# EAGLE design usb tester (EAGLE 6.5.0)
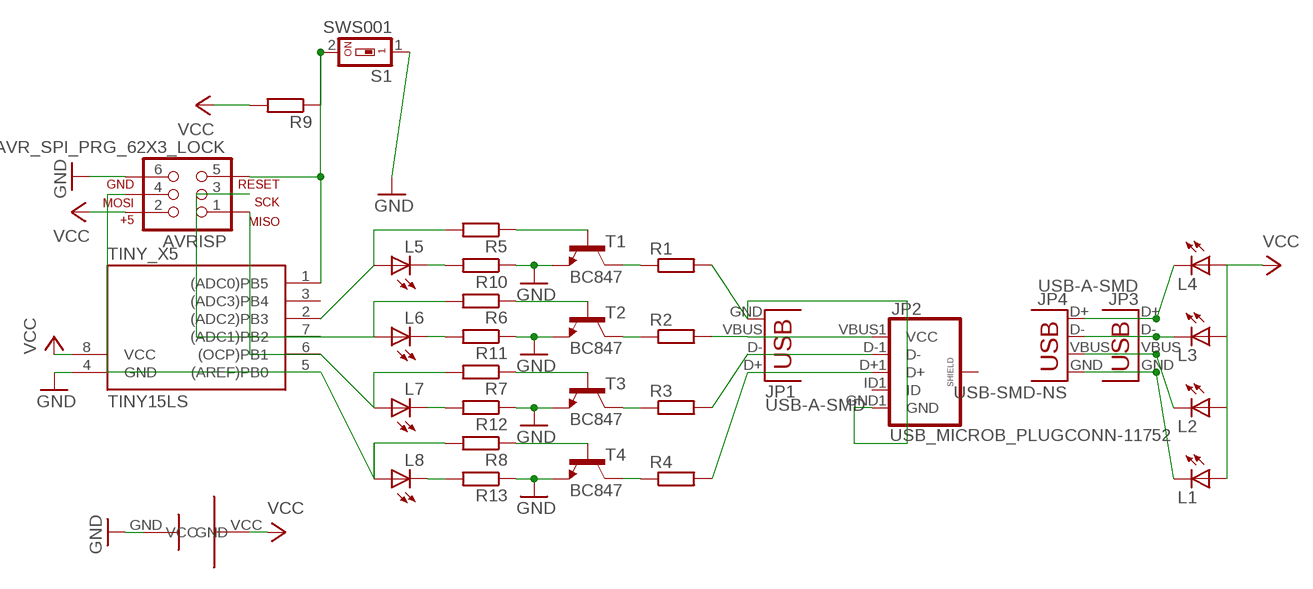
[diagram p0: schematic, sheet 1]

## Parts
AVRISP  AVR_SPI_PRG_62X3_LOCK  [2X3_LOCK]
JP1  USB-A-SMD  [USB-A-S-NOSILK-FEMALE]
JP2  USB_MICROB_PLUGCONN-11752  [USB-B-MICRO-SMD_V03]
JP3  USB-A-SMD  [USB-A-S-NOSILK-FEMALE]
JP4  USB-SMD-NS  [USB-MINIB-NOSTOP]
L1  LEDSMT1206  [1206]
L2  LEDSMT1206  [1206]
L3  LEDSMT1206  [1206]
L4  LEDSMT1206  [1206]
L5  LEDSMT1206  [1206]
L6  LEDSMT1206  [1206]
L7  LEDSMT1206  [1206]
L8  LEDSMT1206  [1206]
R1  R-EU_R1206  [R1206]
R2  R-EU_R1206  [R1206]
R3  R-EU_R1206  [R1206]
R4  R-EU_R1206  [R1206]
R5  R-EU_R1206  [R1206]
R6  R-EU_R1206  [R1206]
R7  R-EU_R1206  [R1206]
R8  R-EU_R1206  [R1206]
R9  R-EU_R1206  [R1206]
R10  R-EU_R1206  [R1206]
R11  R-EU_R1206  [R1206]
R12  R-EU_R1206  [R1206]
R13  R-EU_R1206  [R1206]
S1  SWS001  [SMS-001]
T1  BC847  [SOT23]
T2  BC847  [SOT23]
T3  BC847  [SOT23]
T4  BC847  [SOT23]
TINY_X5  TINY15LS  [SOIC8]
U$1  BATTERY  [BATTERY]

## Nets
GND: AVRISP.6 R10.1 R11.1 R12.1 R13.1 S1.1 T1.2(E) T2.2(E) T3.2(E) T4.2(E) TINY_X5.4(GND) U$1.GND
N$1: R1.1 T1.3(C)
N$2: R2.1 T2.3(C)
N$3: R3.1 T3.3(C)
N$4: R4.1 T4.3(C)
N$5: R5.1 T1.1(B)
N$7: R7.1 T3.1(B)
N$8: AVRISP.1 L7.A R7.2 TINY_X5.6((OCP)PB1)
N$9: R8.1 T4.1(B)
N$10: JP1.GND JP2.GND1(GND) R1.2
N$11: JP1.VBUS JP2.VBUS1(VCC) R2.2
N$12: JP1.D- JP2.D-1(D-) R3.2
N$13: JP1.D+ JP2.D+1(D+) R4.2
N$14: AVRISP.4 L8.A R8.2 TINY_X5.5((AREF)PB0)
N$16: L5.A R5.2 TINY_X5.2((ADC2)PB3)
N$19: JP3.GND JP4.GND L1.C
N$20: JP3.VBUS JP4.VBUS L2.C
N$21: JP3.D- JP4.D- L3.C
N$22: JP3.D+ JP4.D+ L4.C
N$25: L8.C R13.2
N$26: AVRISP.5 R9.1 S1.2 TINY_X5.1((ADC0)PB5)
N$27: AVRISP.3 L6.A R6.2 TINY_X5.7((ADC1)PB2)
N$30: L5.C R10.2
N$31: L6.C R11.2
N$32: L7.C R12.2
N$33: R6.1 T2.1(B)
VCC: AVRISP.2 L1.A L2.A L3.A L4.A R9.2 TINY_X5.8(VCC) U$1.VCC
Unconnected: JP2.ID1(ID) JP2.SHIELD1(SHIELD) JP2.SHIELD2(SHIELD) JP2.SHIELD3(SHIELD) TINY_X5.3((ADC3)PB4)

## Library data of the parts
AVRISP = SparkFun-Connectors:AVR_SPI_PRG_6: AVR ISP 6 Pin This is the reduced ISP connector for AVR programming. Common on Arduino. This footprint will take up less PCB space and can be used with a 10-pin to 6-pin adapter such as SKU: BOB-08508 **Special note about "TEST_POINT" package. The stop mask is on the top side, so if you want your programming test points to be on the bottom of your board, make sure to place this package on the bottom side of the board. This also ensure that the orientation to program from the bottom side will be correct.
JP1 JP3 = SparkFun-Connectors:USB: USB Connectors USB-B-PTH is fully proven SKU : PRT-00139/CONN-08278 USB-miniB is fully proven SKU : PRT-00587 USB-A-PCB is untested. USB-A-H is throughly reviewed, but untested. Spark Fun Electronics SKU : PRT-00437 USB-B-SMT is throughly reviewed, but untested. Needs silkscreen touching up. USB-A-S has not been used/tested USB-MB-H has not been used/tested USB-MICROB has been used. CONN-09505; PROD_ID: CONN-09520
JP2 = SparkFun-Connectors:USB_MICROB_PLUG: USB Micro-B connectors Some male, some female. Watch your step!; PROD_ID: CONN-11752
JP4 = SparkFun-Connectors:USB: USB Connectors USB-B-PTH is fully proven SKU : PRT-00139/CONN-08278 USB-miniB is fully proven SKU : PRT-00587 USB-A-PCB is untested. USB-A-H is throughly reviewed, but untested. Spark Fun Electronics SKU : PRT-00437 USB-B-SMT is throughly reviewed, but untested. Needs silkscreen touching up. USB-A-S has not been used/tested USB-MB-H has not been used/tested USB-MICROB has been used. CONN-09505
L1-L8 = led:LED: LED OSRAM: - CHIPLED LG R971, LG N971, LY N971, LG Q971, LY Q971, LO R971, LY R971 LH N974, LH R974 LS Q976, LO Q976, LY Q976 LO Q996 - Hyper CHIPLED LW Q18S LB Q993, LB Q99A, LB R99A - SideLED LS A670, LO A670, LY A670, LG A670, LP A670 LB A673, LV A673, LT A673, LW A673 LH A674 LY A675 LS A676, LA A676, LO A676, LY A676, LW A676 LS A679, LY A679, LG A679 - Hyper Micro SIDELED® LS Y876, LA Y876, LO Y876, LY Y876 LT Y87S - SmartLED LW L88C, LW L88S LB L89C, LB L89S, LG L890 LS L89K, LO L89K, LY L89K LS L896, LA L896, LO L896, LY L896 - TOPLED LS T670, LO T670, LY T670, LG T670, LP T670 LSG T670, LSP T670, LSY T670, LOP T670, LYG T670 LG T671, LOG T671, LSG T671 LB T673, LV T673, LT T673, LW T673 LH T674 LS T676, LA T676, LO T676, LY T676, LB T676, LH T676, LSB T676, LW T676 LB T67C, LV T67C, LT T67C, LS T67K, LO T67K, LY T67K, LW E67C LS E67B, LA E67B, LO E67B, LY E67B, LB E67C, LV E67C, LT E67C LW T67C LS T679, LY T679, LG T679 LS T770, LO T770, LY T770, LG T770, LP T770 LB T773, LV T773, LT T773, LW T773 LH T774 LS E675, LA E675, LY E675, LS T675 LS T776, LA T776, LO T776, LY T776, LB T776 LHGB T686 LT T68C, LB T68C - Hyper Mini TOPLED® LB M676 - Mini TOPLED Santana® LG M470 LS M47K, LO M47K, LY M47K Source: http://www.osram.convergy.de LUXEON: - LUMILED® LXK2-PW12-R00, LXK2-PW12-S00, LXK2-PW14-U00, LXK2-PW14-V00 LXK2-PM12-R00, LXK2-PM12-S00, LXK2-PM14-U00 LXK2-PE12-Q00, LXK2-PE12-R00, LXK2-PE12-S00, LXK2-PE14-T00, LXK2-PE14-U00 LXK2-PB12-K00, LXK2-PB12-L00, LXK2-PB12-M00, LXK2-PB14-N00, LXK2-PB14-P00, LXK2-PB14-Q00 LXK2-PR12-L00, LXK2-PR12-M00, LXK2-PR14-Q00, LXK2-PR14-R00 LXK2-PD12-Q00, LXK2-PD12-R00, LXK2-PD12-S00 LXK2-PH12-R00, LXK2-PH12-S00 LXK2-PL12-P00, LXK2-PL12-Q00, LXK2-PL12-R00 Source: www.luxeon.com KINGBRIGHT: KA-3528ASYC Source: www.kingbright.com
R1-R13 = rcl:R-EU_: RESISTOR, European symbol
S1 = smd-special:SWS001: SMD Dip Switch 1 pol.
T1-T4 = transistor:BC847: NPN TRANSISTOR
TINY_X5 = atmel:TINY15L: MICROCONTROLLER 2.7 V 1 Kbytes FLASH 64 bytes EEPROM 4-channel 10 bit ADC; OC_FARNELL: unknown; OC_NEWARK: unknown
U$1 = USB_tester:BATTERY

## Board
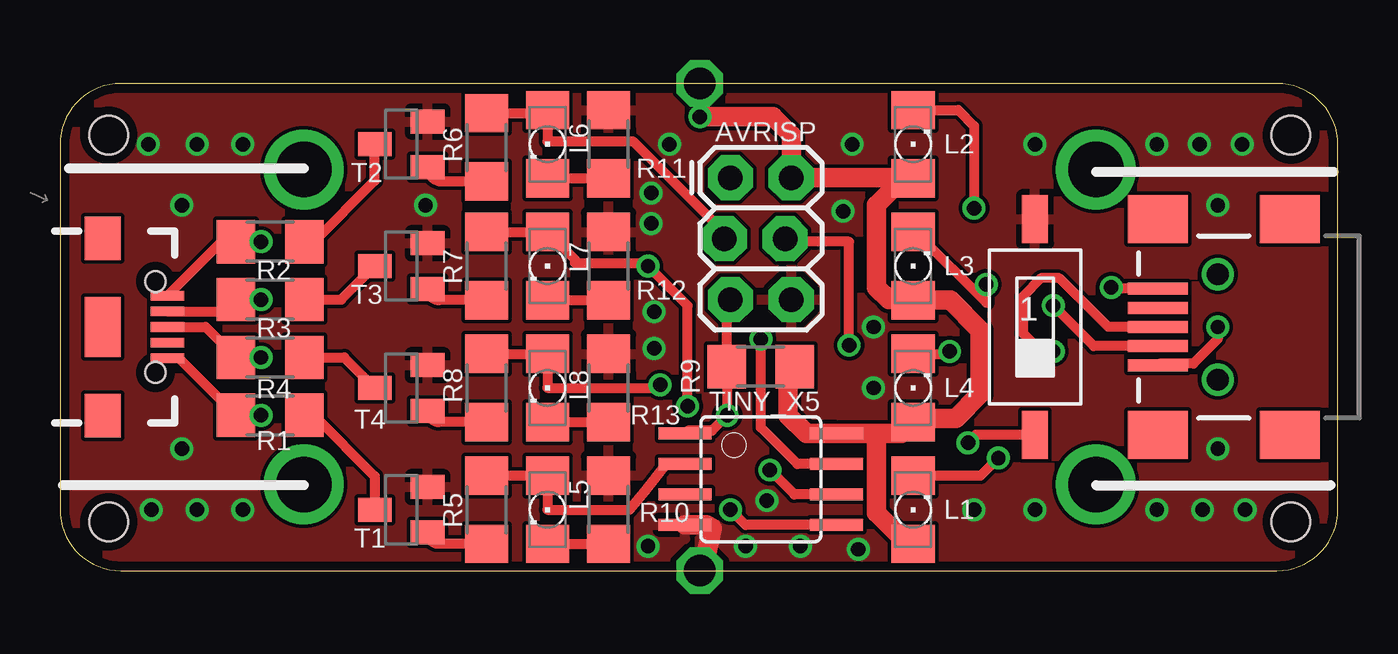
[diagram p1: board, top side]
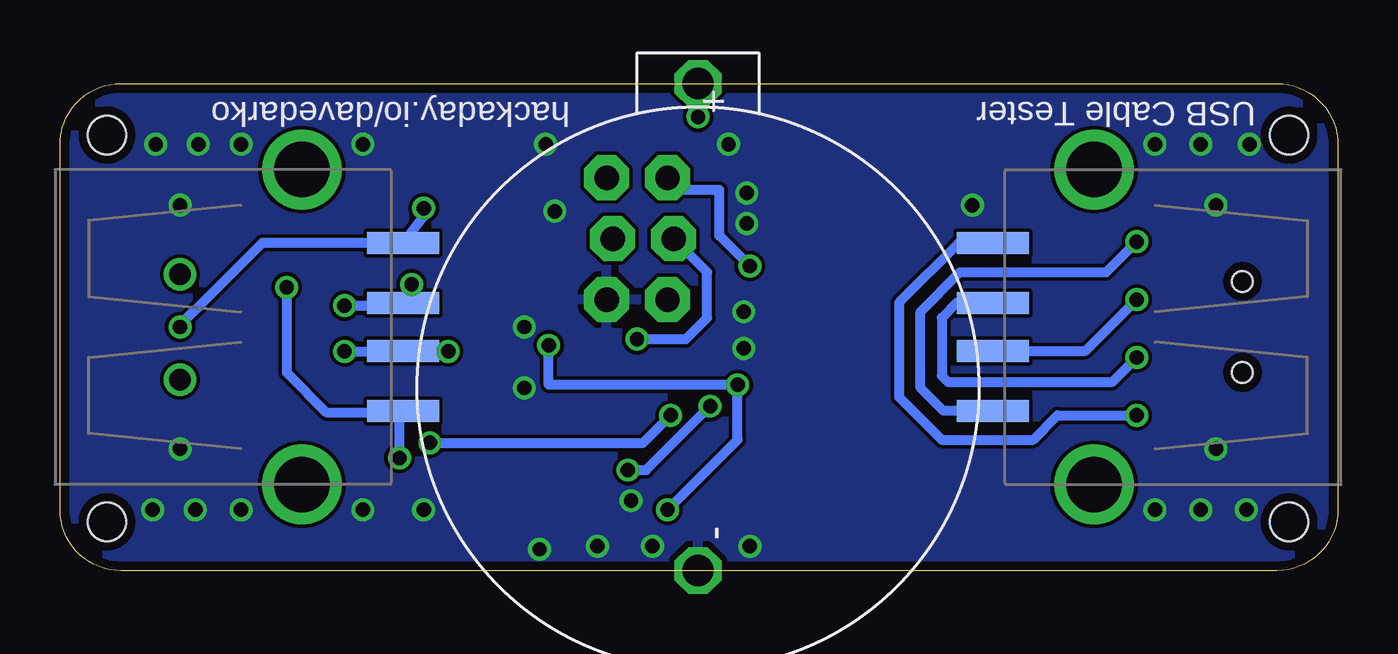
[diagram p2: board, bottom side, seen from below]

Size 53.26 x 20.31 mm. Coordinates in mm from the lower left corner, seen from the top.
Outline: 0,17.77 0,2.54 arc90 2.54,0 50.72,0 arc90 53.26,2.54 53.26,17.77 arc90 50.72,20.31 2.54,20.31 arc90 0,17.77
Copper layers (1*16): Top 0.0356mm / dielectric 1.5011mm / Bottom 0.0356mm
Design rules "LaenPCBOrder *": minimum track width 6mil, minimum drill 13mil, track to track 6mil, track to pad 6mil, pad to pad 6mil, via to via 6mil, smd to smd 6mil, copper to edge 15mil, drill to drill 6mil, minimum pad ring 7mil, minimum via ring 7mil, stop-mask expansion 3mil, vias tented up to drill 2000mil, thermal gap 10mil
Holes 1.6 mm at 51.31,2.03 51.31,18.16 2.03,18.16 2.03,2.03

### Footprints (pad centres in the part's own frame; a part is rotated, then mirrored left to right if it is on the bottom)
2X3_LOCK = drill 1.016 pad 1.88 octagon: 1 0,0; 2 0,2.54; 3 2.54,-0.254; 4 2.54,2.286; 5 5.08,0; 6 5.08,2.54
USB-A-S-NOSILK-FEMALE = smd 3 x 0.9: D+ 4.212,-1; D- 4.212,1; GND 4.212,-3.5; VBUS 4.212,3.5 | drill 2.311: S1 0,-6.566; S2 0,6.566
USB-B-MICRO-SMD_V03 = smd 1.4 x 0.4: D+1 2.7,0; D-1 2.7,0.65; GND1 2.7,-1.3; ID1 2.7,-0.65; VBUS1 2.7,1.3 | smd 1.5 x 1.8: SHIELD1 0,3.7; SHIELD2 0,-3.7 | smd 1.5 x 2.5: SHIELD3 0,0 | hole 0.85: 2.2,1.9; 2.2,-1.9
USB-MINIB-NOSTOP = smd 2.5 x 0.5: D+ 2.5,0; D- 2.5,0.8; GND 2.5,-1.6; ID 2.5,-0.8; VBUS 2.5,1.6 | smd 2.5 x 2: G1 -3,-4.5; G2 -3,4.5; G3 2.5,4.5; G4 2.5,-4.5 | drill 0.9 pad 0.8: H1 0,2.2 | drill 0.9 pad 0.787: H2 0,-2.2
1206 = smd 1.6 x 1.803: A -1.422,0; C 1.422,0
R1206 = smd 1.6 x 1.803: 1 -1.422,0; 2 1.422,0
SMS-001 = smd 1.092 x 2.007: 1 0,-4.496; 2 0,4.496
SOT23 = smd 1 x 1.4: 1 -0.95,-1.1; 2 0.95,-1.1; 3 0,1.1
SOIC8 = smd 0.5 x 2.2: 1 -1.905,-3.154; 2 -0.645,-3.154; 3 0.625,-3.154; 4 1.895,-3.154; 5 1.905,3.154; 6 0.635,3.154; 7 -0.635,3.154; 8 -1.905,3.154
BATTERY = drill 1.3 octagon: GND -10.16,0; VCC 10.16,0

### Placement (x,y rotation side)
AVRISP  27.94,16.38 270 top
JP1  10.16,10.16 180 bottom
JP2  1.78,10.16 0 top
JP3  43.18,10.16 0 bottom
JP4  48.26,10.16 180 top
L1  35.56,2.54 90 top
L2  35.56,17.78 90 top
L3  35.56,12.7 90 top
L4  35.56,7.62 90 top
L5  20.32,2.54 270 top
L6  20.32,17.78 270 top
L7  20.32,12.7 270 top
L8  20.32,7.62 270 top
R1  8.76,6.48 180 top
R2  8.76,13.72 180 top
R3  8.76,11.3 180 top
R4  8.76,8.89 180 top
R5  17.78,2.54 90 top
R6  17.78,17.65 90 top
R7  17.78,12.7 90 top
R8  17.78,7.62 90 top
R9  29.21,8.51 0 top
R10  22.86,2.54 270 top
R11  22.86,17.78 270 top
R12  22.86,12.7 270 top
R13  22.86,7.62 270 top
S1  40.64,10.16 180 top
T1  14.22,2.54 90 top
T2  14.22,17.78 90 top
T3  14.22,12.7 90 top
T4  14.22,7.62 90 top
TINY_X5  29.21,3.81 270 top
U$1  26.67,10.16 90 bottom

### Tracks (layer width: path | path; a pad name or v marks a point on that pad's centre or on a via)
GND  (via drill 0.6)
  Top 0.813: U$1.GND 26.8,0 27.18,1.78 26.95,1.91 TINY_X5.4
  other vias: 40.64,17.78 33.02,17.78 40.64,2.54 49.4,2.54 47.62,2.54 48.26,5.08 48.26,15.24 49.28,17.78 47.5,17.78 32.64,14.99 25.4,17.78 15.24,15.24 5.71,2.54 3.81,2.54 5.08,5.08 5.08,15.24 5.71,17.78 3.68,17.78 24.77,9.27 24.77,10.79 29.46,2.92 38.1,2.54 33.91,10.16 33.91,7.62 7.62,2.54 7.62,17.78 45.72,17.78 45.72,2.54 24.64,14.48 24.64,15.75 33.27,0.89 24.51,1.02 30.86,1.02 28.57,1.02
  pour Top: 0,20.32 53.34,20.32 53.34,0 0,0
  pour Bottom: 0,20.32 55.88,20.32 55.88,0 0,0
N$1
  Top 0.406: R1.1 10.58,6.48 13.12,3.94 T1.3
N$2
  Top 0.406: R2.1 10.58,13.72 13.12,16.26 T2.3
N$3
  Top 0.406: R3.1 11.73,11.3 T3.3
N$4
  Top 0.406: R4.1 11.85,8.89 T4.3
N$5
  Top 0.406: R5.1 15.8,1.12 arc-90 T1.1
N$7
  Top 0.406: R7.1 15.8,11.28 arc-90 T3.1
N$8  (via drill 0.6)
  Top 0.406: R7.2 L7.A 21.46,12.98 21.46,12.83 24.38,12.83 v24.51,12.7 26.16,11.05 v26.16,6.86 | TINY_X5.6 30.61,3.17 v29.59,4.19
  Bottom 0.406: v24.51,12.7 25.78,13.97 25.78,15.88 27.43,15.88 AVRISP.1 | v29.59,4.19 28.83,4.19 v26.16,6.86
N$9
  Top 0.406: R8.1 15.8,6.2 arc-90 T4.1
N$10  (via drill 0.6)
  Top 0.406: JP2.GND1 4.96,8.86 R1.2 v8.38,6.48
  Bottom 0.406: JP1.GND 15.8,13.66 18.29,11.18 18.29,7.24 16.51,5.46 12.7,5.46 11.68,6.48 v8.38,6.48
N$11  (via drill 0.6)
  Top 0.406: JP2.VBUS1 6.73,13.72 R2.2 v8.38,13.72
  Bottom 0.406: JP1.VBUS 16.44,6.66 17.4,7.62 17.4,10.79 15.75,12.45 9.65,12.45 v8.38,13.72
N$12  (via drill 0.6)
  Top 0.406: JP2.D-1 6.85,10.81 R3.2 v8.38,11.3
  Bottom 0.406: JP1.D- 10.53,9.16 v8.38,11.3
N$13  (via drill 0.6)
  Top 0.406: JP2.D+1 6.07,10.16 6.85,9.39 R4.2 v8.38,8.89
  Bottom 0.406: JP1.D+ 15.89,11.16 16.51,10.54 16.51,8.13 16.26,7.87 9.4,7.87 v8.38,8.89
N$14  (via drill 0.6)
  Top 0.406: R8.2 L8.A 20.32,7.62 24.89,7.62 v25.02,7.75 | v32.89,9.4 32.89,13.72 30.35,13.72 AVRISP.4 | TINY_X5.5 28.57,1.91 v27.94,2.54
  Bottom 0.406: v32.89,9.4 32.89,7.75 v25.02,7.75 25.02,5.46 v27.94,2.54
N$16
  Top 0.406: R5.2 L5.A 20.32,2.54 23.75,2.54 24.38,3.3 25.28,4.45 TINY_X5.2
N$19  (via drill 0.6)
  Top 0.406: JP4.GND 43.87,11.76 v43.81,11.81 | L1.C 38.38,3.96 v39.12,4.7
  Bottom 0.406: v43.81,11.81 43.81,8.26 42.16,6.6 39.28,6.6 JP3.GND 39.12,6.55 v39.12,4.7
N$20  (via drill 0.6)
  Top 0.406: v48.26,10.16 48.26,9.65 47.24,8.64 45.84,8.64 JP4.VBUS | L2.C 37.44,19.2 38.1,18.54 v38.1,15.11
  Bottom 0.406: v48.26,10.16 48.26,10.29 47.37,11.12 44.83,13.66 JP3.VBUS 38.1,14.78 v38.1,15.11
N$21  (via drill 0.6)
  Top 0.406: JP4.D- 43.09,9.36 v41.4,11.05 | L3.C 35.66,14.12 38.61,11.18 v38.61,11.94
  Bottom 0.406: v41.4,11.05 39.33,11.05 JP3.D- 38.61,11.77 v38.61,11.94
N$22  (via drill 0.6)
  Top 0.406: JP4.D+ 43.69,10.16 41.66,12.19 40.89,12.19 40.13,11.43 40.13,9.91 40.89,9.14 v41.4,9.14 | L4.C 37.11,9.04 v37.08,9.14
  Bottom 0.406: v41.4,9.14 39.24,9.14 JP3.D+ 39.21,9.14 v37.08,9.14
N$25
  Top 0.406: L8.C R13.2
N$26  (via drill 0.6)
  Top 0.406: AVRISP.5 27.79,11.15 R9.1 27.81,8.1 v27.81,6.48 27.18,5.84 26.18,5.84 TINY_X5.1 | S1.2 38.18,5.66 v37.85,5.33
  Bottom 0.406: v37.85,5.33 28.96,5.33 v27.81,6.48
N$27  (via drill 0.6)
  Top 0.406: R6.2 20.19,19.07 arc90 L6.A 20.32,17.91 23.88,17.91 27.81,13.97 27.56,13.97 AVRISP.3 | TINY_X5.7 30.73,4.45 29.21,5.97 v29.21,9.65
  Bottom 0.406: v29.21,9.65 27.18,9.65 26.29,10.54 26.29,12.45 AVRISP.3
N$30
  Top 0.406: L5.C R10.2
N$31
  Top 0.406: L6.C R11.2
N$32
  Top 0.406: L7.C R12.2
N$33
  Top 0.406: R6.1 15.92,16.23 arc-90 T2.1
VCC  (via drill 0.6)
  Top 0.406: 30.35,7.75 30.63,8.03 R9.2 | 35.08,5.71 L4.A 35.71,6.35 | 35.53,16.38 L2.A 35.15,16.36 | 35.53,11.3 L3.A | L1.A 35.33,1.12 | 34.04,5.59 34.16,5.71
  Top 0.813: 30.35,7.75 30.35,6.48 31.11,5.71 TINY_X5.8 34.16,5.71 35.08,5.71 | 35.53,16.38 AVRISP.2 30.48,18.16 29.72,18.92 v26.67,18.92 | 35.15,16.36 34.04,15.24 34.04,11.81 34.54,11.3 35.53,11.3 | L3.A 37.11,11.28 38.35,10.03 38.35,7.37 37.34,6.35 35.71,6.35 | 35.33,1.12 34.04,2.41 34.04,5.59
  Bottom 0.813: U$1.VCC v26.67,18.92

### Text on the board
bNames: USB Cable Tester | hackaday.io/davedarko